# Altium project PorTeL_beacon_board.PrjPcb
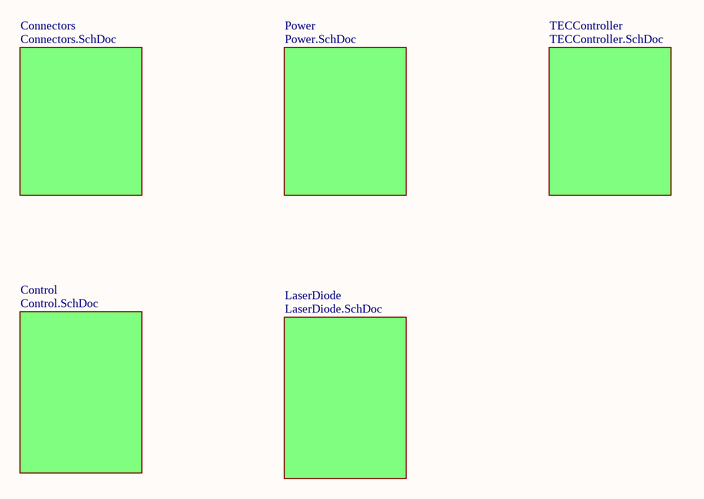
[diagram p0: Top.SchDoc]
6 sheets, 146 parts. Net scope: flat (ports and power ports of the same name join across sheets).
Board file: PCB_power.PcbDoc
Sheets:
  Top.SchDoc
    Connectors = Connectors.SchDoc
    Power = Power.SchDoc
    Control = Control.SchDoc
    LaserDiode = LaserDiode.SchDoc
    TECController = TECController.SchDoc

## Sheet Top.SchDoc
size A; SheetNumber: 1; SheetTotal: 6

### Sub-sheets
Connectors = Connectors.SchDoc: no entries
Control = Control.SchDoc: no entries
LaserDiode = LaserDiode.SchDoc: no entries
Power = Power.SchDoc: no entries
TECController = TECController.SchDoc: no entries

## Sheet Connectors.SchDoc
size A; SheetNumber: 2; SheetTotal: 6
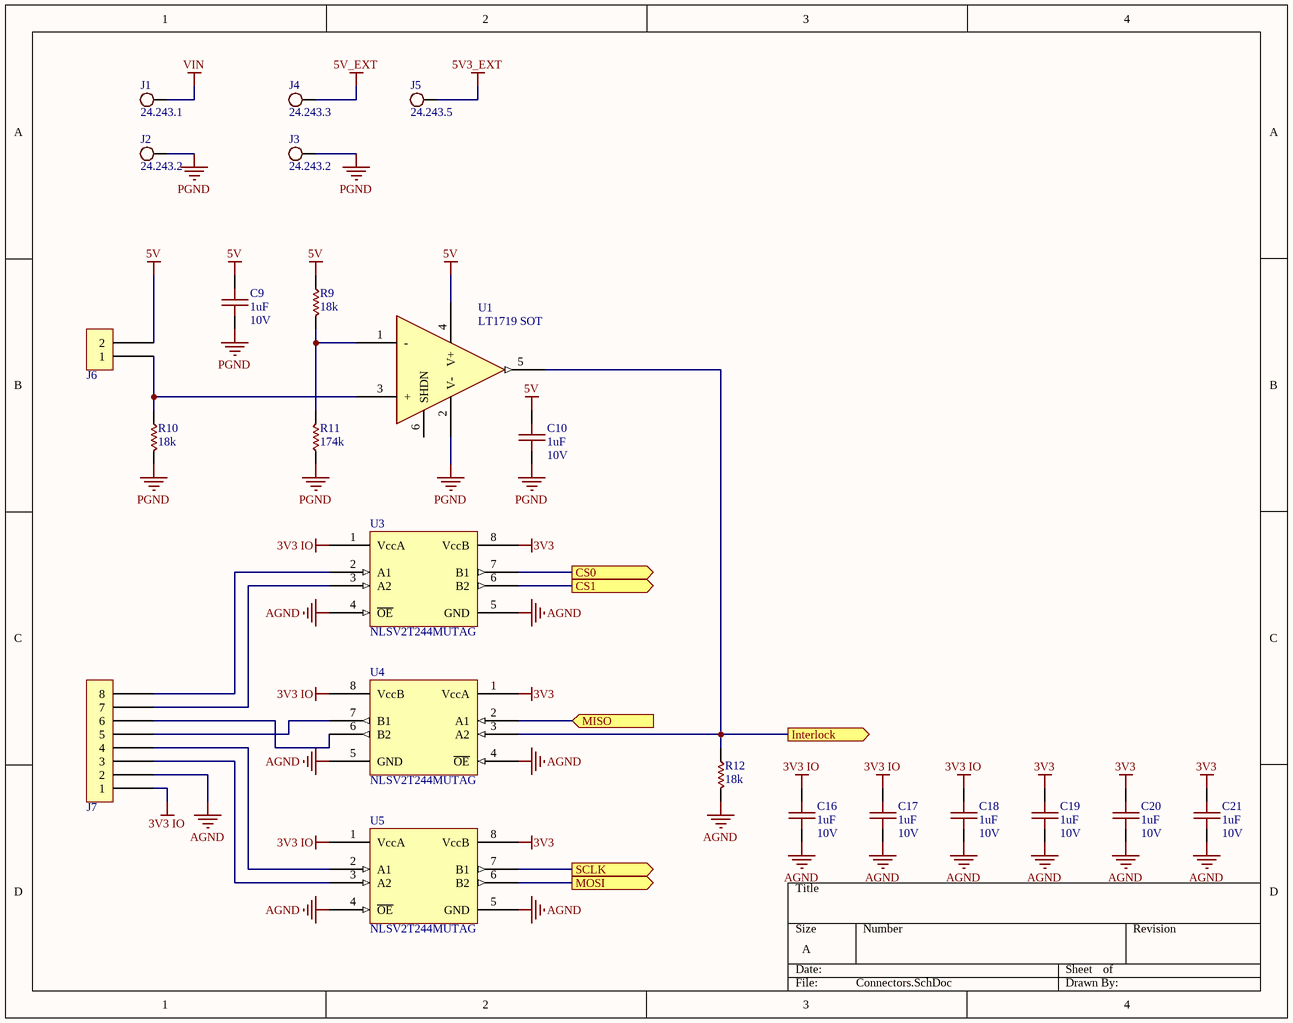
[diagram p1: Connectors.SchDoc]

### Parts
C9  1uF  Voltage: 10V  [0603 B]
C10  1uF  Voltage: 10V  [0603 B]
C16  1uF  Voltage: 10V  [0603 B]
C17  1uF  Voltage: 10V  [0603 B]
C18  1uF  Voltage: 10V  [0603 B]
C19  1uF  Voltage: 10V  [0603 B]
C20  1uF  Voltage: 10V  [0603 B]
C21  1uF  Voltage: 10V  [0603 B]
J1  24.243.1  [BANANA RD]  (no BOM)
J2  24.243.2  [BANANA BK]  (no BOM)
J3  24.243.2  [BANANA BK]  (no BOM)
J4  24.243.3  [BANANA YL]  (no BOM)
J5  24.243.5  [BANANA BU]  (no BOM)
J6  SIL02  [SIL02]  (value not drawn)
J7  SIL08  [SIL08]  (value not drawn)
R9  18k  [0603]
R10  18k  [0603]
R11  174k  [0603]
R12  18k  [0603]
U1  LT1719 SOT  [TSOT-23-6]
U3  NLSV2T244MUTAG  [UDFN8]
U4  NLSV2T244MUTAG  [UDFN8]
U5  NLSV2T244MUTAG  [UDFN8]

### Ports
CS0 (out), CS1 (out), Interlock (out), MISO (in), MOSI (out), SCLK (out)

### Nets
3V3: C19.2 C20.2 C21.2 U3.8(VccB) U4.1(VccA) U5.8(VccB)
3V3 IO: C16.2 C17.2 C18.2 J7.1 U3.1(VccA) U4.8(VccB) U5.1(VccA)
5V: C9.2 C10.2 J6.2 R9.2 U1.4(V+)
5V3_EXT: J5.1(TP)
5V_EXT: J4.1(TP)
AGND: C16.1 C17.1 C18.1 C19.1 C20.1 C21.1 J7.2 R12.1 U3.4(~{OE}) U3.5(GND) U4.4(~{OE}) U4.5(GND) U5.4(~{OE}) U5.5(GND)
PGND: C9.1 C10.1 J2.1(TP) J3.1(TP) R10.1 R11.2 U1.2(V-)
VIN: J1.1(TP)
CS0: U3.7(B1) ; port CS0
CS1: U3.6(B2) ; port CS1
MISO: U4.2(A1) ; port MISO
MOSI: U5.6(B2) ; port MOSI
SCLK: U5.7(B1) ; port SCLK
NetJ6_1: J6.1 R10.2 U1.3(+)
NetJ7_3: J7.3 U5.3(A2)
NetJ7_4: J7.4 U5.2(A1)
NetJ7_5: J7.5 U4.7(B1)
NetJ7_6: J7.6 U4.6(B2)
NetJ7_7: J7.7 U3.3(A2)
NetJ7_8: J7.8 U3.2(A1)
NetR9_1: R9.1 R11.1 U1.1(-)
NetR12_2: R12.2 U1.5(OUT) U4.3(A2) ; port Interlock

Not connected (* = marked no-connect by the designer): U1 6(SHDN)

### Library data of the parts
C9 C10 C16-C21 = CAP 0603: 603 Capacitor; Ref: C1608X7R1E105M080AB; Rating: X7R; Value: 1uF
J1 = BANANA RED: Banana jack, PCB mount right angle; Ref: 24.243.1
J2 J3 = BANANA BLACK: Banana jack, PCB mount right angle; Ref: 24.243.2
J4 = BANANA YELLOW: Banana jack, PCB mount right angle; Ref: 24.243.3
J5 = BANANA BLUE: Banana jack, PCB mount right angle; Ref: 24.243.5
J6 = SIL02: 2.54mm Header 1x2; Ref: 4x1 2.54MM HEADER
J7 = SIL08: 2.54mm Header 1x6; Ref: 4x1 2.54MM HEADER
R9-R12 = RES 0603: 603 Resistor
  R9 R10 R12: Value: 18k
  R11: Value: 174k
U1 = LT1719 SOT: 4.5ns Comparator with rail-torail output; Ref: LT1719IS6#PBF
U3-U5 = NLSV2T244MUTAG: Voltage Level Translator Unidirectional 1 Circuit 2 Channel - 8-UDFN (1.8x1.2); Supplier 1: Digi-Key; Supplier Part Number 1: NLSV2T244MUTAGOSCT-ND; Ref: NLSV2T244MUTAG

## Sheet Power.SchDoc
size C; SheetNumber: 3; SheetTotal: 6
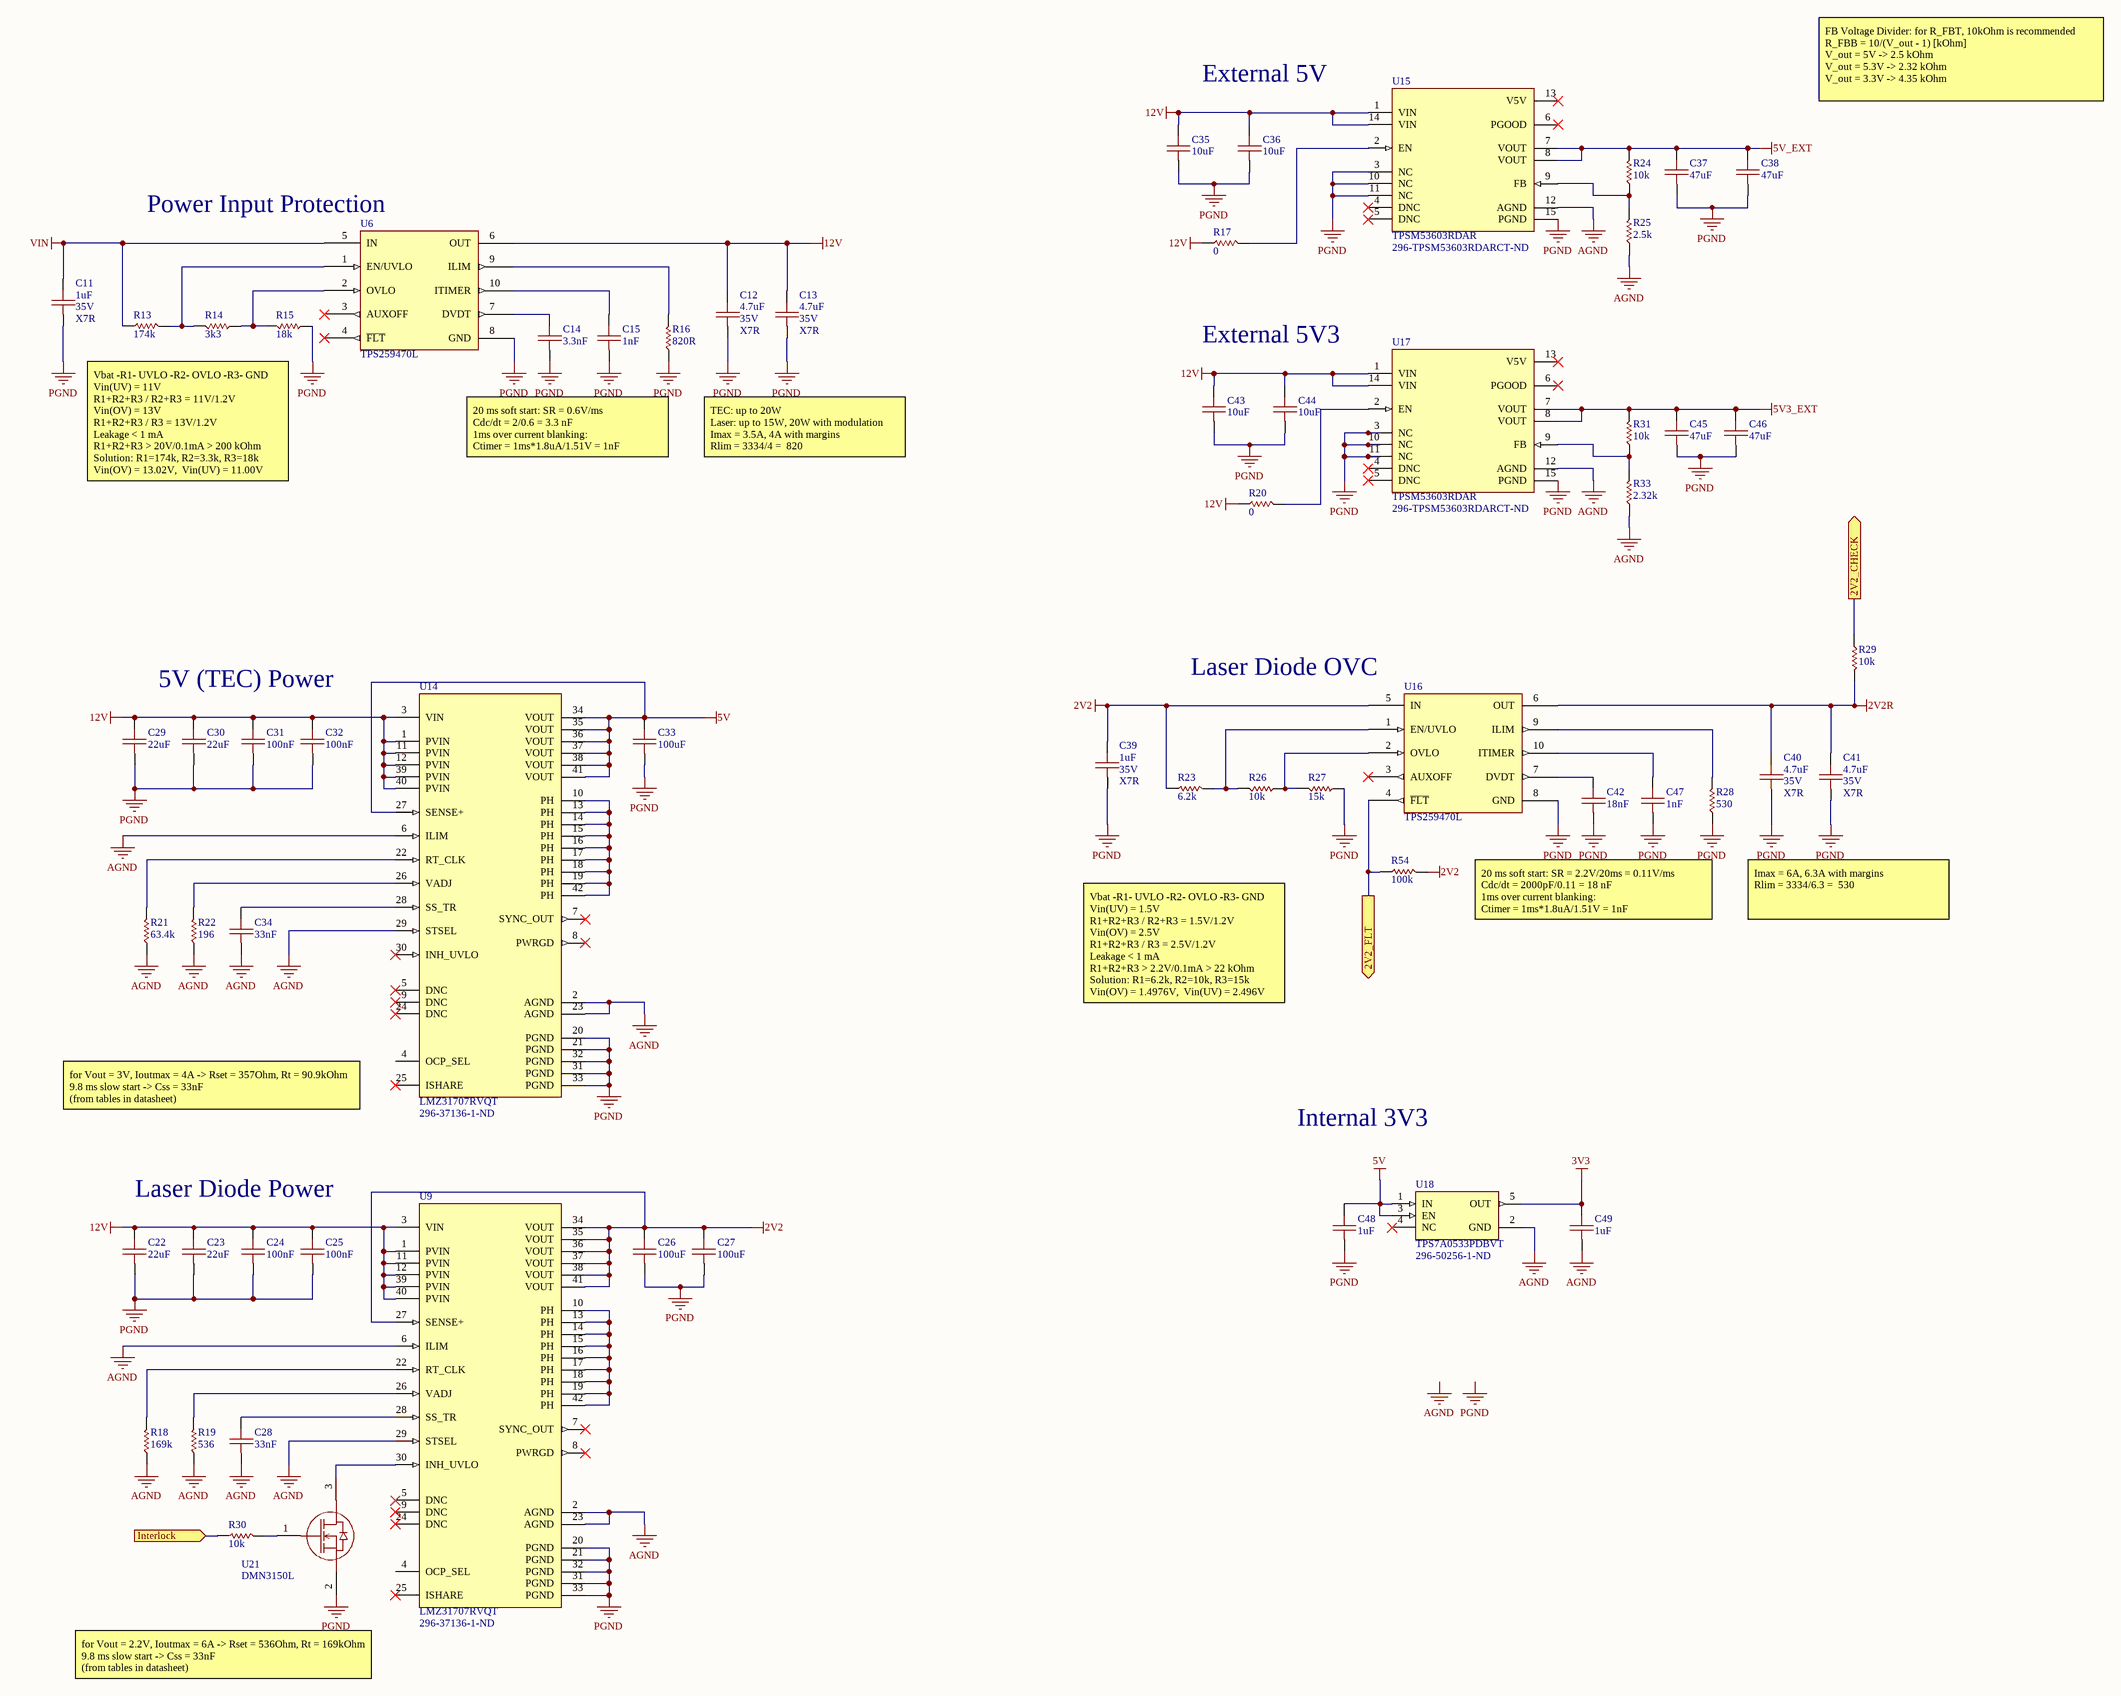
[diagram p2: Power.SchDoc]

### Parts
C11  1uF  Voltage: 35V  Type: X7R  [0805 B]
C12  4.7uF  Voltage: 35V  Type: X7R  [0805 B]
C13  4.7uF  Voltage: 35V  Type: X7R  [0805 B]
C14  3.3nF  [0603 B]
C15  1nF  [0603 B]
C22  22uF  [1210]
C23  22uF  [1210]
C24  100nF  [0603 B]
C25  100nF  [0603 B]
C26  100uF  [1206 B]
C27  100uF  [1206 B]
C28  33nF  [0603 B]
C29  22uF  [1210]
C30  22uF  [1210]
C31  100nF  [0603 B]
C32  100nF  [0603 B]
C33  100uF  [1206 B]
C34  33nF  [0603 B]
C35  10uF  [0603 B]
C36  10uF  [0603 B]
C37  47uF  [0603 B]
C38  47uF  [0603 B]
C39  1uF  Voltage: 35V  Type: X7R  [0805 B]
C40  4.7uF  Voltage: 35V  Type: X7R  [0805 B]
C41  4.7uF  Voltage: 35V  Type: X7R  [0805 B]
C42  18nF  [0603 B]
C43  10uF  [0603 B]
C44  10uF  [0603 B]
C45  47uF  [0603 B]
C46  47uF  [0603 B]
C47  1nF  [0603 B]
C48  1uF  [0603 B]
C49  1uF  [0603 B]
R13  174k  [0603]
R14  3k3  [0603]
R15  18k  [0603]
R16  820R  [0603]
R17  0  [0603]
R18  169k  [0805]
R19  536  [0805]
R20  0  [0603]
R21  63.4k  [0805]
R22  196  [0805]
R23  6.2k  [0603]
R24  10k  [0805]
R25  2.5k  [0805]
R26  10k  [0603]
R27  15k  [0603]
R28  530  [0603]
R29  10k  [0603]
R30  10k  [0603]
R31  10k  [0805]
R33  2.32k  [0805]
R54  100k  [0603]
U6  TPS259470L  [VQFN-HR 2x2]
U9  LMZ31707RVQT  Supplier Part Number 1: 296-37136-1-ND  [PB3QFN]
U14  LMZ31707RVQT  Supplier Part Number 1: 296-37136-1-ND  [PB3QFN]
U15  TPSM53603RDAR  Supplier Part Number 1: 296-TPSM53603RDARCT-ND  [RDA0015A]
U16  TPS259470L  [VQFN-HR 2x2]
U17  TPSM53603RDAR  Supplier Part Number 1: 296-TPSM53603RDARCT-ND  [RDA0015A]
U18  TPS7A0533PDBVT  Supplier Part Number 1: 296-50256-1-ND  [DBV0005A-MFG]
U21  DMN3150L  [SOT-23]

### Ports
2V2_CHECK (out), 2V2_FLT (out), Interlock (in)

### Nets
2V2: C26.2 C27.2 C39.2 R23.2 R54.1 U9.27(SENSE+) U9.34(VOUT) U9.35(VOUT) U9.36(VOUT) U9.37(VOUT) U9.38(VOUT) U9.41(VOUT) U16.5(IN)
2V2R: C40.2 C41.2 R29.1 U16.6(OUT)
3V3: C49.2 U18.5(OUT)
5V: C33.2 C48.2 U14.27(SENSE+) U14.34(VOUT) U14.35(VOUT) U14.36(VOUT) U14.37(VOUT) U14.38(VOUT) U14.41(VOUT) U18.1(IN) U18.3(EN)
5V3_EXT: C45.2 C46.2 R31.1 U17.7(VOUT) U17.8(VOUT)
5V_EXT: C37.2 C38.2 R24.1 U15.7(VOUT) U15.8(VOUT)
12V: C12.2 C13.2 C22.2 C23.2 C24.2 C25.2 C29.2 C30.2 C31.2 C32.2 C35.2 C36.2 C43.2 C44.2 R17.2 R20.2 U6.6(OUT) U9.1(PVIN) U9.3(VIN) U9.11(PVIN) U9.12(PVIN) U9.39(PVIN) U9.40(PVIN) U14.1(PVIN) U14.3(VIN) U14.11(PVIN) U14.12(PVIN) U14.39(PVIN) U14.40(PVIN) U15.1(VIN) U15.14(VIN) U17.1(VIN) U17.14(VIN)
AGND: C28.1 C34.1 C49.1 R18.2 R19.2 R21.2 R22.2 R25.2 R33.2 U9.2(AGND) U9.6(ILIM) U9.23(AGND) U9.29(STSEL) U14.2(AGND) U14.6(ILIM) U14.23(AGND) U14.29(STSEL) U15.12(AGND) U17.12(AGND) U18.2(GND)
PGND: C11.1 C12.1 C13.1 C14.1 C15.1 C22.1 C23.1 C24.1 C25.1 C26.1 C27.1 C29.1 C30.1 C31.1 C32.1 C33.1 C35.1 C36.1 C37.1 C38.1 C39.1 C40.1 C41.1 C42.1 C43.1 C44.1 C45.1 C46.1 C47.1 C48.1 R15.2 R16.2 R27.2 R28.2 U6.8(GND) U9.20(PGND) U9.21(PGND) U9.31(PGND) U9.32(PGND) U9.33(PGND) U14.20(PGND) U14.21(PGND) U14.31(PGND) U14.32(PGND) U14.33(PGND) U15.3(NC) U15.10(NC) U15.11(NC) U15.15(PGND) U16.8(GND) U17.3(NC) U17.10(NC) U17.11(NC) U17.15(PGND) U21.2(S)
VIN: C11.2 R13.2 U6.5(IN)
2V2 FLT: R54.2 U16.4(~{FLT}) ; port 2V2_FLT
2V2 MON: R29.2 ; port 2V2_CHECK
NetC14_2: C14.2 U6.7(DVDT)
NetC15_2: C15.2 U6.10(ITIMER)
NetC28_2: C28.2 U9.28(SS_TR)
NetC34_2: C34.2 U14.28(SS_TR)
NetC42_2: C42.2 U16.7(DVDT)
NetC47_2: C47.2 U16.10(ITIMER)
NetR12_2: R30.2 ; port Interlock
NetR13_1: R13.1 R14.1 U6.1(EN/UVLO)
NetR14_2: R14.2 R15.1 U6.2(OVLO)
NetR16_1: R16.1 U6.9(ILIM)
NetR17_1: R17.1 U15.2(EN)
NetR18_1: R18.1 U9.22(RT_CLK)
NetR19_1: R19.1 U9.26(VADJ)
NetR20_1: R20.1 U17.2(EN)
NetR21_1: R21.1 U14.22(RT_CLK)
NetR22_1: R22.1 U14.26(VADJ)
NetR23_1: R23.1 R26.1 U16.1(EN/UVLO)
NetR24_2: R24.2 R25.1 U15.9(FB)
NetR26_2: R26.2 R27.1 U16.2(OVLO)
NetR28_1: R28.1 U16.9(ILIM)
NetR30_1: R30.1 U21.1(G)
NetR31_2: R31.2 R33.1 U17.9(FB)
NetU9_10: U9.10(PH) U9.13(PH) U9.14(PH) U9.15(PH) U9.16(PH) U9.17(PH) U9.18(PH) U9.19(PH) U9.42(PH)
NetU9_30: U9.30(INH_UVLO) U21.3(D)
NetU14_10: U14.10(PH) U14.13(PH) U14.14(PH) U14.15(PH) U14.16(PH) U14.17(PH) U14.18(PH) U14.19(PH) U14.42(PH)

Not connected (* = marked no-connect by the designer): U6 3(AUXOFF)* 4(~{FLT})*; U9 4(OCP_SEL) 5(DNC)* 7(SYNC_OUT)* 8(PWRGD)* 9(DNC)* 24(DNC)* 25(ISHARE)*; U14 4(OCP_SEL) 5(DNC)* 7(SYNC_OUT)* 8(PWRGD)* 9(DNC)* 24(DNC)* 25(ISHARE)* 30(INH_UVLO)*; U15 4(DNC)* 5(DNC)* 6(PGOOD)* 13(V5V)*; U16 3(AUXOFF)*; U17 4(DNC)* 5(DNC)* 6(PGOOD)* 13(V5V)*; U18 4(NC)*

### Notes on the sheet
- External 5V
- FB Voltage Divider: for R_FBT, 10kOhm is recommended
  R_FBB = 10/(V_out - 1) [kOhm]
  V_out = 5V -> 2.5 kOhm
  V_out = 5.3V -> 2.32 kOhm
  V_out = 3.3V -> 4.35 kOhm
- (near U6) Power Input Protection
- External 5V3
- Vbat -R1- UVLO -R2- OVLO -R3- GND
  Vin(UV) = 11V
  R1+R2+R3 / R2+R3 = 11V/1.2V
  Vin(OV) = 13V
  R1+R2+R3 / R3 = 13V/1.2V
  Leakage < 1 mA
  R1+R2+R3 > 20V/0.1mA > 200 kOhm
  Solution: R1=174k, R2=3.3k, R3=18k
  Vin(OV) = 13.02V,  Vin(UV) = 11.00V
- 20 ms soft start: SR = 0.6V/ms
  Cdc/dt = 2/0.6 = 3.3 nF
  1ms over current blanking:
  Ctimer = 1ms*1.8uA/1.51V = 1nF
- TEC: up to 20W
  Laser: up to 15W, 20W with modulation
  Imax = 3.5A, 4A with margins
  Rlim = 3334/4 =  820
- (near U16) Laser Diode OVC
- 5V (TEC) Power
- 20 ms soft start: SR = 2.2V/20ms = 0.11V/ms
  Cdc/dt = 2000pF/0.11 = 18 nF
  1ms over current blanking:
  Ctimer = 1ms*1.8uA/1.51V = 1nF
- Imax = 6A, 6.3A with margins
  Rlim = 3334/6.3 =  530
- Vbat -R1- UVLO -R2- OVLO -R3- GND
  Vin(UV) = 1.5V
  R1+R2+R3 / R2+R3 = 1.5V/1.2V
  Vin(OV) = 2.5V
  R1+R2+R3 / R3 = 2.5V/1.2V
  Leakage < 1 mA
  R1+R2+R3 > 2.2V/0.1mA > 22 kOhm
  Solution: R1=6.2k, R2=10k, R3=15k
  Vin(OV) = 1.4976V,  Vin(UV) = 2.496V
- for Vout = 3V, Ioutmax = 4A -> Rset = 357Ohm, Rt = 90.9kOhm
  9.8 ms slow start -> Css = 33nF
  (from tables in datasheet)
- Internal 3V3
- Laser Diode Power
- for Vout = 2.2V, Ioutmax = 6A -> Rset = 536Ohm, Rt = 169kOhm
  9.8 ms slow start -> Css = 33nF
  (from tables in datasheet)
- Labels drawn without touching a wire or pin: AGND, PGND

### Library data of the parts
C11-C13 C39-C41 = CAP 0805: 805 Capacitor
  C11 C39: Value: 1uF
  C12 C13 C40 C41: Value: 4.7uF
C14 C15 C24 C25 C28 C31 C32 C34-C38 C42-C49 = CAP 0603: 603 Capacitor
  C14: Value: 3.3nF
  C15 C47: Value: 1nF
  C24 C25 C31 C32: Value: 100nF
  C28 C34: Value: 33nF
  C35 C36 C43 C44: Value: 10uF
  C37 C38 C45 C46: Value: 47uF
  C42: Value: 18nF
  C48 C49: Value: 1uF
C22 C23 C29 C30 = CAP 1210: 1210 Capacitor; Value: 22uF
C26 C27 C33 = CAP 1206: 1206 Capacitor; Value: 100uF
R13-R17 R20 R23 R26-R30 R54 = RES 0603: 603 Resistor
  R13: Value: 174k
  R14: Value: 3k3
  R15: Value: 18k
  R16: Value: 820R
  R17 R20: Value: 0
  R23: Value: 6.2k
  R26 R29 R30: Value: 10k
  R27: Value: 15k
  R28: Value: 530
  R54: Value: 100k
R18 R19 R21 R22 R24 R25 R31 R33 = RES 0805: 805 Resistor
  R18: Value: 169k
  R19: Value: 536
  R21: Value: 63.4k
  R22: Value: 196
  R24 R31: Value: 10k
  R25: Value: 2.5k
  R33: Value: 2.32k
U6 U16 = TPS259470L: 2.7-23 V, 5.5 A, 28 mΩ True Reverse Current Blocking eFuse with Input Reverse Polarity Protection; Ref: TPS259470L
U9 U14 = LMZ31707RVQT: Non-Isolated DC/DC Converters 7A Power Module w/ 2.95V-17V Input; PartNumber: LMZ31707RVQR; Manufacturer: Texas Instruments; RefDes: RefDes; Type: DEV; Value: Value; Copyright: Copyright (C) 2018 Accelerated Designs. All rights reserved; Supplier 1: Digi-Key
U15 U17 = TPSM53603RDAR: 36-V, 3-A step-down power module in small 5.5 x 5 x 4-mm Enhanced HotRod™ QFN with simple footprint; Manufacturer: Texas Instruments; PartNumber: TPSM53603RDAR; RefDes: RefDes; Type: DEV; Value: Value; Copyright: Copyright (C) 2018 Accelerated Designs. All rights reserved; Supplier 1: Digi-Key
U18 = TPS7A0533PDBVT: Linear Voltage Regulator IC Positive Fixed 1 Output 200mA SOT-23-5; PartNumber: TPS7A2050PDBVR; Manufacturer: Texas Instruments; RefDes: RefDes; Type: DEV; Value: Value; Copyright: Copyright (C) 2021 Accelerated Designs. All rights reserved; Supplier 1: Digi-Key
U21 = DMN3150L: Power-Transistor; Ref: DMN3150L

## Sheet Control.SchDoc
size A; SheetNumber: 4; SheetTotal: 6
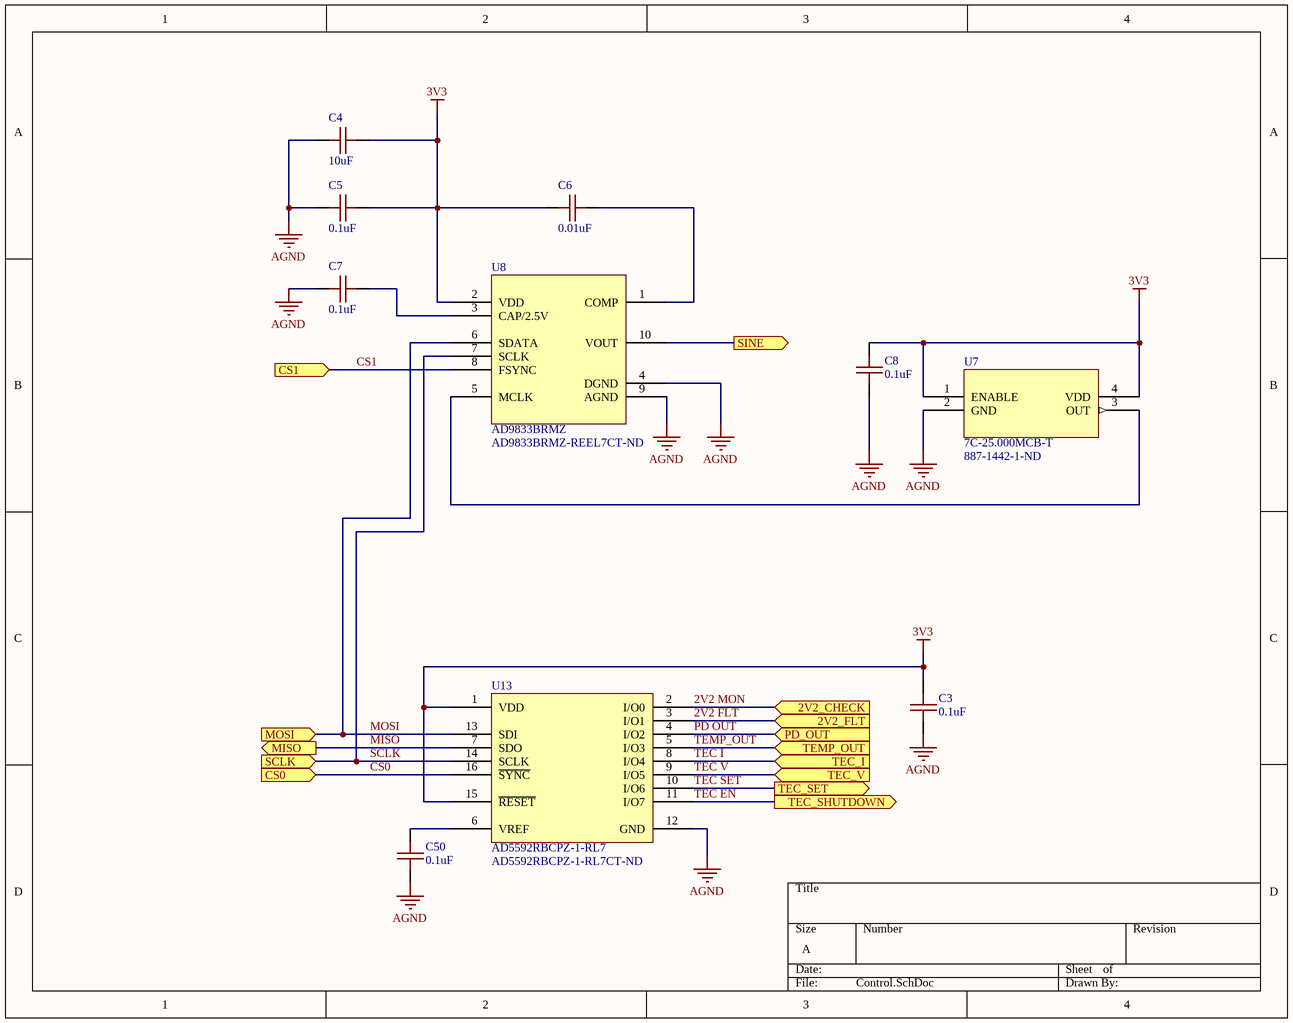
[diagram p3: Control.SchDoc]

### Parts
C3  0.1uF  [0603 B]
C4  10uF  [0603 B]
C5  0.1uF  [0603 B]
C6  0.01uF  [0603 B]
C7  0.1uF  [0603 B]
C8  0.1uF  [0603 B]
C50  0.1uF  [0603 B]
U7  7C-25.000MCB-T  Supplier Part Number 1: 887-1442-1-ND  [OSC_TXC_7C_TXC]
U8  AD9833BRMZ  Supplier Part Number 1: AD9833BRMZ-REEL7CT-ND  [RM_10_ADI]
U13  AD5592RBCPZ-1-RL7  Supplier Part Number 1: AD5592RBCPZ-1-RL7CT-ND  [LFCSP CP 16 2]

### Ports
2V2_CHECK (in), 2V2_FLT (in), CS0 (in), CS1 (in), MISO (out), MOSI (in), PD_OUT (in), SCLK (in), SINE (out), TEC_I (in), TEC_SET (out), TEC_SHUTDOWN (out), TEC_V (in), TEMP_OUT (in)

### Nets
3V3: C3.1 C4.2 C5.2 C6.1 C8.2 U7.1(ENABLE) U7.4(VDD) U8.2(VDD) U13.1(VDD) U13.15(~{RESET})
AGND: C3.2 C4.1 C5.1 C7.1 C8.1 C50.1 U7.2(GND) U8.4(DGND) U8.9(AGND) U13.12(GND)
2V2 FLT: U13.3(I/O1) ; port 2V2_FLT
2V2 MON: U13.2(I/O0) ; port 2V2_CHECK
CS0: U13.16(~{SYNC}) ; port CS0
CS1: U8.8(FSYNC) ; port CS1
MISO: U13.7(SDO) ; port MISO
MOSI: U8.6(SDATA) U13.13(SDI) ; port MOSI
PD OUT: U13.4(I/O2) ; port PD_OUT
SCLK: U8.7(SCLK) U13.14(SCLK) ; port SCLK
TEC EN: U13.11(I/O7) ; port TEC_SHUTDOWN
TEC I: U13.8(I/O4) ; port TEC_I
TEC SET: U13.10(I/O6) ; port TEC_SET
TEC V: U13.9(I/O5) ; port TEC_V
TEMP_OUT: U13.5(I/O3) ; port TEMP_OUT
NetC6_2: C6.2 U8.1(COMP)
NetC7_2: C7.2 U8.3(CAP/2.5V)
NetC50_2: C50.2 U13.6(VREF)
NetR2_2: U8.10(VOUT) ; port SINE
NetU7_3: U7.3(OUT) U8.5(MCLK)

### Library data of the parts
C3-C8 C50 = CAP 0603: 603 Capacitor
  C3 C5 C7 C8 C50: Value: 0.1uF
  C4: Value: 10uF
  C6: Value: 0.01uF
U7 = 7C-25.000MCB-T: 25 MHz XO (Standard) CMOS Oscillator 2.5V Enable/Disable 4-SMD, No Lead; Vendor: TXC; Built_By: EMA_UL_Team; SourceLibrary: TXC_2011-01-01_OSC_7C; Manufacturer_Part_Number: 7C-25.000MCB-T; Copyright: Copyright (C) 2021 Accelerated Designs. All rights reserved; RefDes: RefDes; Type: DEV; ComponentLink1Description: New link; ComponentLink1URL: *; Supplier 1: Digi-Key
U8 = AD9833BRMZ: Low Power, 12.65 mW, 2.3 V to 5.5 V, Programmable Waveform Generator; Vendor: Analog Devices Inc; SourceLibrary: Analog_2015-12-15; Built_By: EMA_UL_Team; Manufacturer_Part_Number: AD9833BRMZ; Copyright: Copyright (C) 2018 Accelerated Designs. All rights reserved; RefDes: RefDes; Type: DEV; Supplier 1: Digi-Key
U13 = AD5592RBCPZ-1-RL7: 8-Channel, 12-Bit, Configurable ADC/DAC with On-Chip Reference, SPI Interface, LFCSP; SourceLibrary: Analog_2015-12-15; Built_By: EMA_UL_Team; Vendor: Analog Devices Inc; Manufacturer_Part_Number: AD5592RBCPZ-1-RL7; Copyright: Copyright (C) 2021 Accelerated Designs. All rights reserved; RefDes: RefDes; Type: DEV; Supplier 1: Digi-Key

## Sheet LaserDiode.SchDoc
size B; SheetNumber: 5; SheetTotal: 6
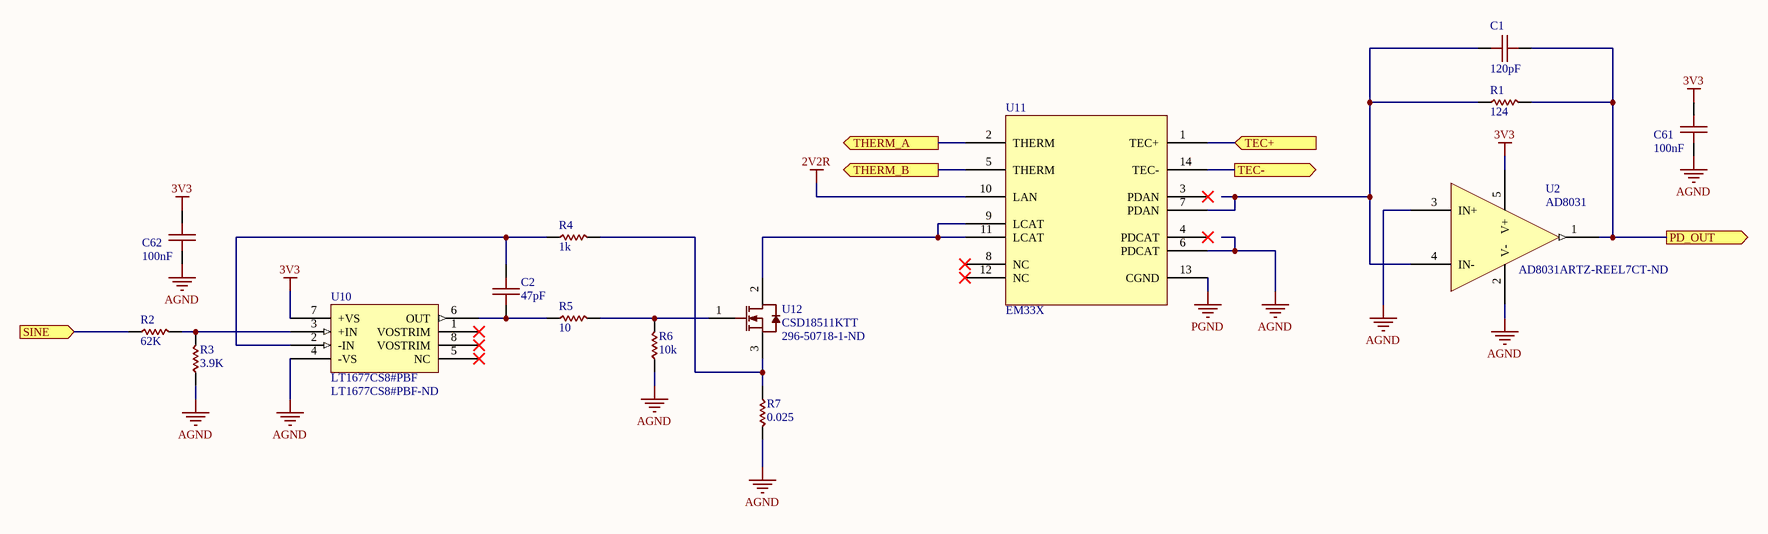
[diagram p4: LaserDiode.SchDoc]

### Parts
C1  120pF  [0603 B]
C2  47pF  [0603 B]
C61  100nF  [0603 B]
C62  100nF  [0603 B]
R1  124  [0805]
R2  62K  [0805]
R3  3.9K  [0805]
R4  1k  [0805]
R5  10  [0805]
R6  10k  [0805]
R7  0.025  [1206]
U2  AD8031  Supplier Part Number 1: AD8031ARTZ-REEL7CT-ND  [TSOT-23-5]
U10  LT1677CS8#PBF  Supplier Part Number 1: LT1677CS8#PBF-ND  [SO-8_S_LIT]
U11  EM33X  [AC1409]
U12  CSD18511KTT  Supplier Part Number 1: 296-50718-1-ND  [DPAK]

### Ports
PD_OUT (out), SINE (in), TEC+ (in), TEC- (out), THERM_A (out), THERM_B (out)

### Nets
2V2R: U11.10(LAN)
3V3: C61.1 C62.1 U2.5(V+) U10.7(+VS)
AGND: C61.2 C62.2 R3.2 R6.2 R7.1 U2.2(V-) U2.3(IN+) U10.4(-VS) U11.6(PDCAT)
PGND: U11.13(CGND)
PD OUT: C1.1 R1.1 U2.1(OUT) ; port PD_OUT
NetC1_2: C1.2 R1.2 U2.4(IN-) U11.7(PDAN)
NetC2_1: C2.1 R4.2 U10.2(-IN)
NetC2_2: C2.2 R5.2 U10.6(OUT)
NetC54_2: U11.1(TEC+) ; port TEC+
NetC55_2: U11.14(TEC-) ; port TEC-
NetR2_1: R2.1 R3.1 U10.3(+IN)
NetR2_2: R2.2 ; port SINE
NetR4_1: R4.1 R7.2 U12.3(S)
NetR5_1: R5.1 R6.1 U12.1(G)
NetR43_1: U11.2(THERM) ; port THERM_A
NetR51_2: U11.5(THERM) ; port THERM_B
NetU11_9: U11.9(LCAT) U11.11(LCAT) U12.2(D)

Not connected (* = marked no-connect by the designer): U10 1(VOSTRIM)* 5(NC)* 8(VOSTRIM)*; U11 3(PDAN)* 4(PDCAT)* 8(NC)* 12(NC)*

### Library data of the parts
C1 C2 C61 C62 = CAP 0603: 603 Capacitor
  C1: Value: 120pF
  C2: Value: 47pF
  C61 C62: Value: 100nF
R1-R6 = RES 0805: 805 Resistor
  R1: Value: 124
  R2: Value: 62K
  R3: Value: 3.9K
  R4: Value: 1k
  R5: Value: 10
  R6: Value: 10k
R7 = RES 1206: 1206 Resistor; Value: 0.025
U2 = AD8031: 2.7V, 800 uA, 80 MHz Rail-to-Rail I/O Amplifiers; Ref: AD8031; Supplier 1: Digi-Key
U10 = LT1677CS8#PBF: Low Noise, Rail-to-Rail Precision Op Amp; Vendor: Linear Technology; Built_By: EMA_UL_Team; SourceLibrary: LinearTech_2016-05-13_8; Manufacturer_Part_Number: LT1677CS8#PBF; Copyright: Copyright (C) 2018 Accelerated Designs. All rights reserved; RefDes: RefDes; Type: DEV; Supplier 1: Digi-Key
U11 = EM33X: 5W Cooled 9XX Multimode Lasers in 14-Pin Package
U12 = CSD18511KTT: 40-V, N channel NexFET™ power MOSFET, single D2PAK, 2.6 mOhm; Vendor: Texas Instruments; Built_By: EMA_Jessica; SourceLibrary: TI_2019-05-10; Manufacturer_Part_Number: CSD18511KTT; Copyright: Copyright (C) 2018 Accelerated Designs. All rights reserved; RefDes: RefDes; Type: DEV; Supplier 1: Digi-Key

## Sheet TECController.SchDoc
size 381 x 241 mm; SheetNumber: 6; SheetTotal: 6
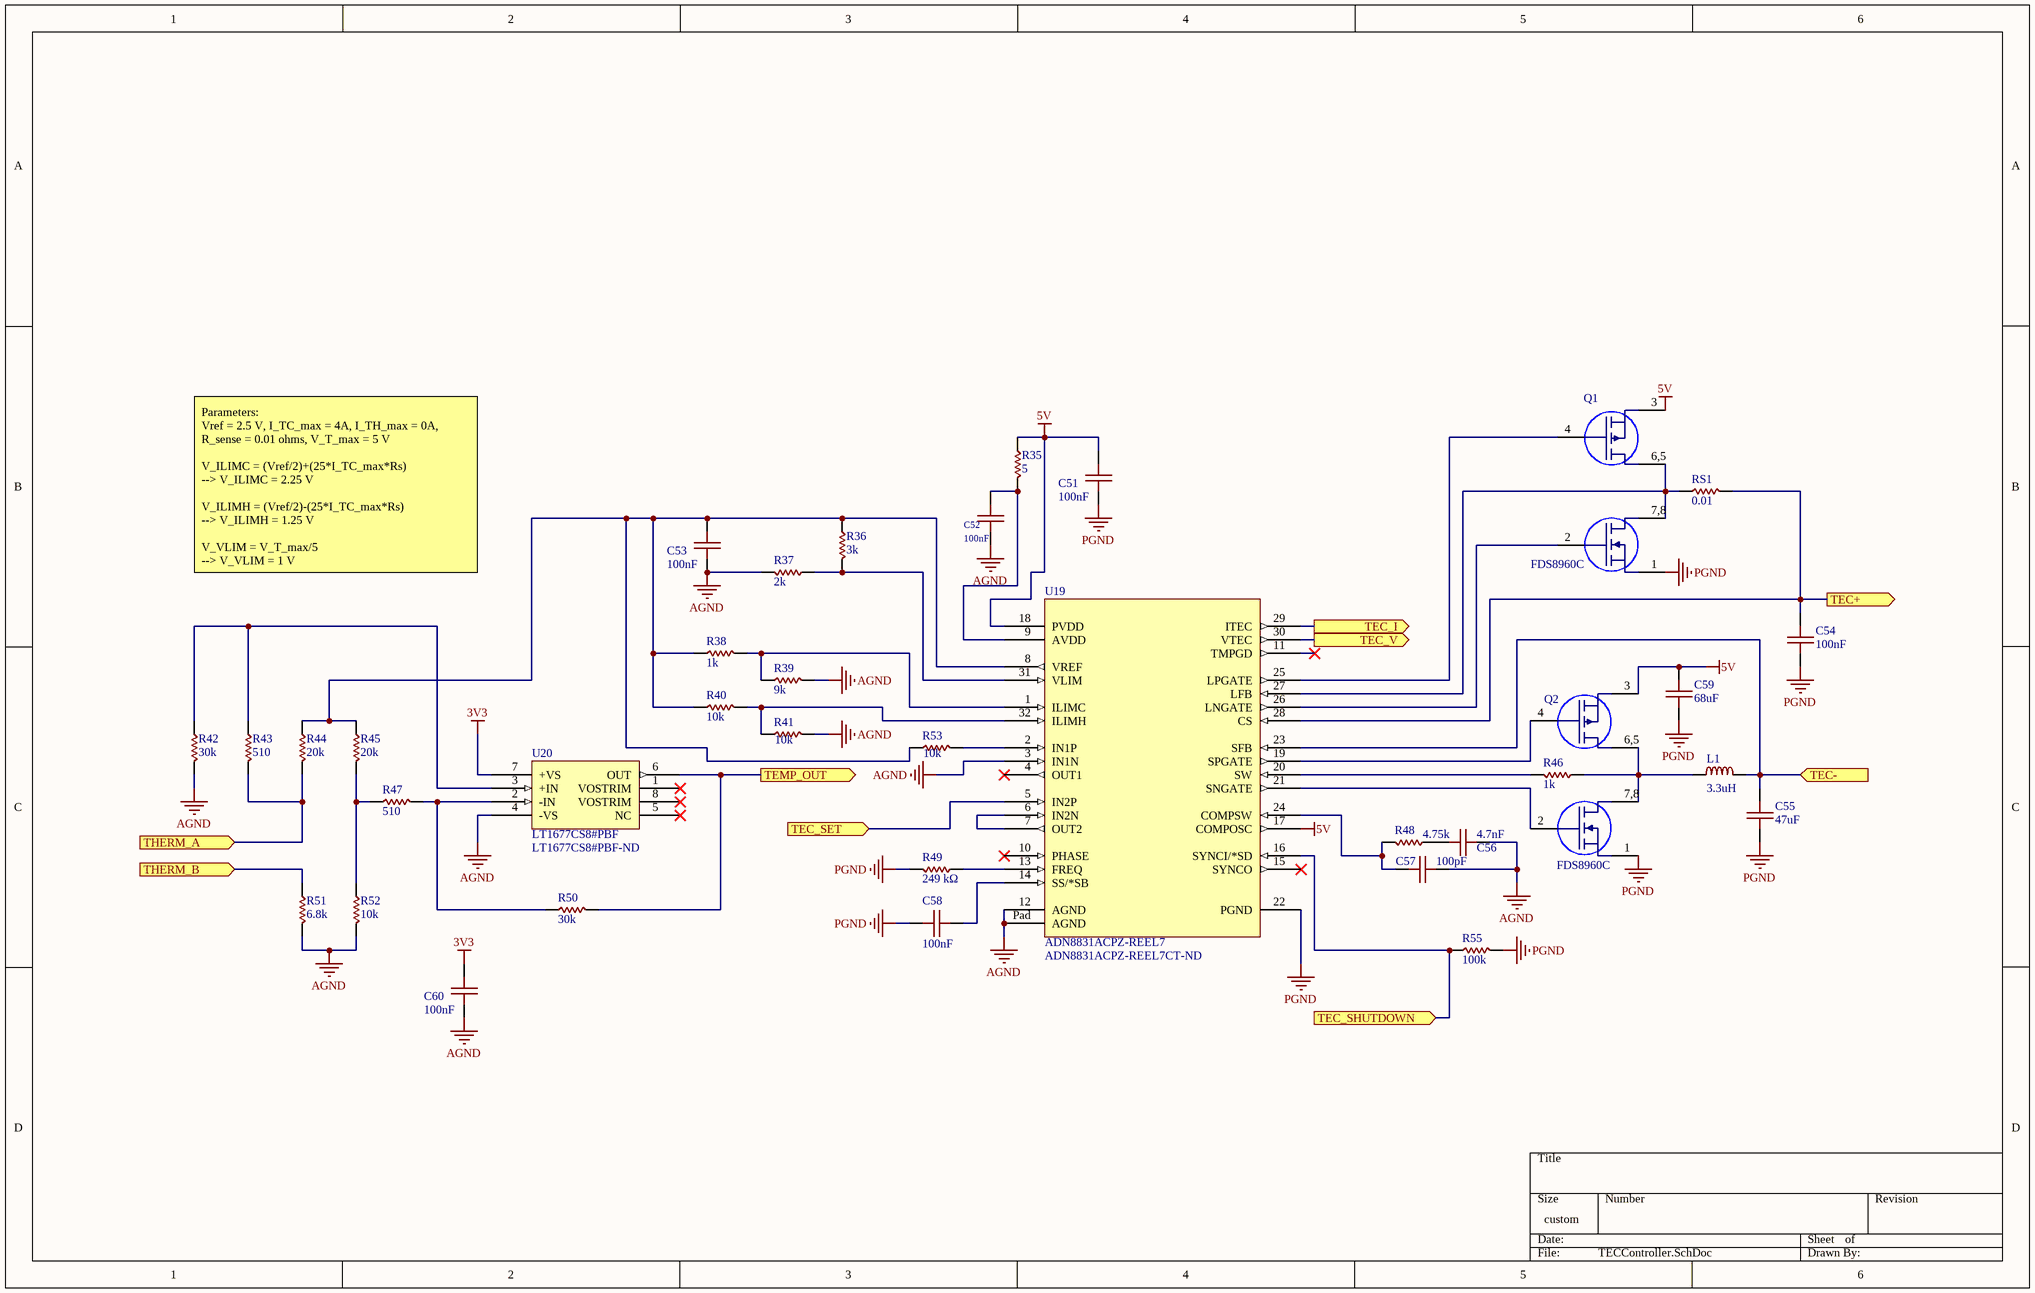
[diagram p5: TECController.SchDoc]

### Parts
C51  100nF  [0603 B]
C52  100nF  [0603 B]
C53  100nF  [0603 B]
C54  100nF  [0603 B]
C55  47uF  [0805 B]
C56  4.7nF  [0603 B]
C57  100pF  [0603 B]
C58  100nF  [0603 B]
C59  68uF  [1206 B]
C60  100nF  [0603 B]
L1  3.3uH  [SRP0520]
Q1  FDS8960C  [SO-8]
Q2  FDS8960C  [SO-8]
R35  5  [0805]
R36  3k  [0603]
R37  2k  [0603]
R38  1k  [0603]
R39  9k  [0603]
R40  10k  [0603]
R41  10k  [0603]
R42  30k  [0603]
R43  510  [0603]
R44  20k  [0603]
R45  20k  [0603]
R46  1k  [0603]
R47  510  [0603]
R48  4.75k  [0603]
R49  249 kΩ  [0603]
R50  30k  [0603]
R51  6.8k  [0603]
R52  10k  [0603]
R53  10k  [0603]
R55  100k  [0603]
RS1  0.01  [1206]
U19  ADN8831ACPZ-REEL7  Supplier Part Number 1: ADN8831ACPZ-REEL7CT-ND  [LFCSP CP 32 7]
U20  LT1677CS8#PBF  Supplier Part Number 1: LT1677CS8#PBF-ND  [SO-8_S_LIT]

### Ports
TEC+ (out), TEC- (in), TEC_I (out), TEC_SET (in), TEC_SHUTDOWN (in), TEC_V (out), TEMP_OUT (out), THERM_A (in), THERM_B (in)

### Nets
3V3: C60.1 U20.7(+VS)
5V: C51.1 C59.2 Q1.3 Q2.3 R35.2 U19.17(COMPOSC) U19.18(PVDD)
AGND: C52.2 C53.2 C56.2 C57.2 C60.2 R37.1 R39.1 R41.1 R42.1 R51.1 R52.1 U19.3(IN1N) U19.12(AGND) U19.Pad(AGND) U20.4(-VS)
PGND: C51.2 C54.1 C55.1 C58.1 C59.1 Q1.1 Q2.1 R49.1 R55.1 U19.22(PGND)
TEC EN: R55.2 U19.16(SYNCI/*SD) ; port TEC_SHUTDOWN
TEC I: U19.29(ITEC) ; port TEC_I
TEC SET: U19.5(IN2P) ; port TEC_SET
TEC V: U19.30(VTEC) ; port TEC_V
TEMP_OUT: R50.1 U20.6(OUT) ; port TEMP_OUT
NetC52_1: C52.1 R35.1 U19.9(AVDD)
NetC53_1: C53.1 R36.2 R38.2 R40.2 R44.2 R45.2 R53.2 U19.8(VREF)
NetC54_2: C54.2 RS1.1 U19.28(CS) ; port TEC+
NetC55_2: C55.2 L1.1 U19.23(SFB) ; port TEC-
NetC56_1: C56.1 R48.2
NetC57_1: C57.1 R48.1 U19.24(COMPSW)
NetC58_2: C58.2 U19.14(SS/*SB)
NetL1_2: L1.2 Q2.6,5 Q2.7,8 R46.2
NetQ1_2: Q1.2 U19.26(LNGATE)
NetQ1_4: Q1.4 U19.25(LPGATE)
NetQ1_6,5: Q1.6,5 Q1.7,8 RS1.2 U19.27(LFB)
NetQ2_2: Q2.2 U19.21(SNGATE)
NetQ2_4: Q2.4 U19.19(SPGATE)
NetR36_1: R36.1 R37.2 U19.31(VLIM)
NetR38_1: R38.1 R39.2 U19.1(ILIMC)
NetR40_1: R40.1 R41.2 U19.32(ILIMH)
NetR42_2: R42.2 R43.2 U20.3(+IN)
NetR43_1: R43.1 R44.1 ; port THERM_A
NetR45_1: R45.1 R47.2 R52.2
NetR46_1: R46.1 U19.20(SW)
NetR47_1: R47.1 R50.2 U20.2(-IN)
NetR49_2: R49.2 U19.13(FREQ)
NetR51_2: R51.2 ; port THERM_B
NetR53_1: R53.1 U19.2(IN1P)
NetU19_6: U19.6(IN2N) U19.7(OUT2)

Not connected (* = marked no-connect by the designer): U19 4(OUT1)* 10(PHASE)* 11(TMPGD)* 15(SYNCO)*; U20 1(VOSTRIM)* 5(NC)* 8(VOSTRIM)*

### Notes on the sheet
- Parameters:
  Vref = 2.5 V, I_TC_max = 4A, I_TH_max = 0A, R_sense = 0.01 ohms, V_T_max = 5 V
  V_ILIMC = (Vref/2)+(25*I_TC_max*Rs)
  --> V_ILIMC = 2.25 V
  V_ILIMH = (Vref/2)-(25*I_TC_max*Rs)
  --> V_ILIMH = 1.25 V
  V_VLIM = V_T_max/5
  --> V_VLIM = 1 V

### Library data of the parts
C51-C54 C56-C58 C60 = CAP 0603: 603 Capacitor
  C51-C54 C58 C60: Value: 100nF
  C56: Value: 4.7nF
  C57: Value: 100pF
C55 = CAP 0805: 805 Capacitor; Value: 47uF
C59 = CAP 1206: 1206 Capacitor; Value: 68uF
L1 = IND 3.3uH 4.8A SMD: Bourns SRP0520 3.3uH 4.8A Inductor; Ref: IHLP3232DZER330M11; Value: 3.3uH
Q1 Q2 = FDS8960C: MOSFET pair
R35 = RES 0805: 805 Resistor; Value: 5
R36 = RES 0603: 603 Resistor; Value: 6k
R37 = RES 0603: 603 Resistor; Value: 4k
R38-R48 R50-R53 R55 = RES 0603: 603 Resistor
  R38 R46: Value: 1k
  R39: Value: 9k
  R40 R41 R52 R53: Value: 10k
  R42 R50: Value: 30k
  R43 R47: Value: 510
  R44 R45: Value: 20k
  R48: Value: 4.75k
  R51: Value: 6.8k
  R55: Value: 100k
R49 = RES 0603: 603 Resistor; Value: 249k
RS1 = RES 1206: 1206 Resistor; Value: 0.01
U19 = ADN8831ACPZ-REEL7: A High Efficiency TEC Controller Solution; SourceLibrary: Analog_2015-01-06; Built_By: EMA_UL_Team; Vendor: Analog Devices Inc; Manufacturer_Part_Number: ADN8831ACPZ-REEL7; Copyright: Copyright (C) 2018 Accelerated Designs. All rights reserved; RefDes: RefDes; Type: DEV; Supplier 1: Digi-Key
U20 = LT1677CS8#PBF: as U10 on sheet LaserDiode; Manufacturer_Part_Number: LT1677CS8#PBF; Copyright: Copyright (C) 2018 Accelerated Designs. All rights reserved; RefDes: RefDes; Type: DEV; Supplier 1: Digi-Key

## Nets that join several sheets
2V2R: Power (C40.2 C41.2 R29.1 U16.6), LaserDiode (U11.10)
3V3: Connectors (6 pins), Power (C49.2 U18.5), Control (10 pins), LaserDiode (C61.1 C62.1 U2.5 U10.7), TECController (C60.1 U20.7)
5V: Connectors (5 pins), Power (11 pins), TECController (7 pins)
5V3_EXT: Connectors (J5.1), Power (5 pins)
5V_EXT: Connectors (J4.1), Power (5 pins)
AGND: Connectors (14 pins), Power (20 pins), Control (10 pins), LaserDiode (9 pins), TECController (15 pins)
PGND: Connectors (7 pins), Power (55 pins), LaserDiode (U11.13), TECController (10 pins)
VIN: Connectors (J1.1), Power (C11.2 R13.2 U6.5)
2V2 FLT: Power (R54.2 U16.4), Control (U13.3)
2V2 MON: Power (R29.2), Control (U13.2)
CS0: Connectors (U3.7), Control (U13.16)
CS1: Connectors (U3.6), Control (U8.8)
MISO: Connectors (U4.2), Control (U13.7)
MOSI: Connectors (U5.6), Control (U8.6 U13.13)
NetC54_2: LaserDiode (U11.1), TECController (C54.2 RS1.1 U19.28)
NetC55_2: LaserDiode (U11.14), TECController (C55.2 L1.1 U19.23)
NetR2_2: Control (U8.10), LaserDiode (R2.2)
NetR12_2: Connectors (R12.2 U1.5 U4.3), Power (R30.2)
NetR43_1: LaserDiode (U11.2), TECController (R43.1 R44.1)
NetR51_2: LaserDiode (U11.5), TECController (R51.2)
PD OUT: Control (U13.4), LaserDiode (C1.1 R1.1 U2.1)
SCLK: Connectors (U5.7), Control (U8.7 U13.14)
TEC EN: Control (U13.11), TECController (R55.2 U19.16)
TEC I: Control (U13.8), TECController (U19.29)
TEC SET: Control (U13.10), TECController (U19.5)
TEC V: Control (U13.9), TECController (U19.30)
TEMP_OUT: Control (U13.5), TECController (R50.1 U20.6)